# Altium schematic sheet Sheet4.SchDoc
size B; SheetNumber: 4; SheetTotal: 4
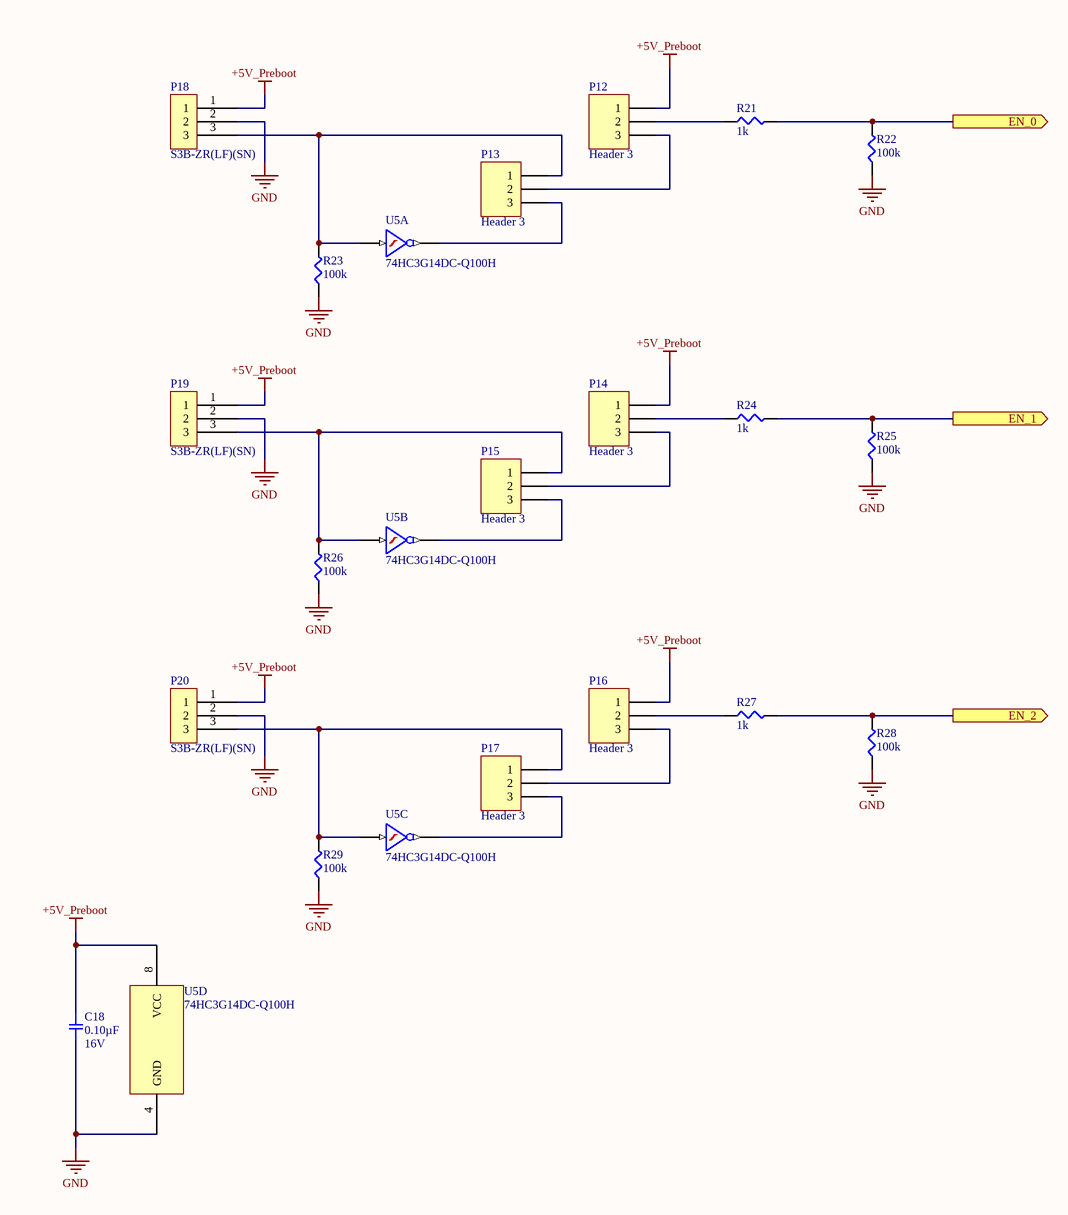
[diagram p0: Sheet4.SchDoc]

## Parts
C18  0.10µF  Voltage: 16V  [SMD-0402C]
P12  Header 3  [HDR1X3]  (no BOM)
P13  Header 3  [HDR1X3]  (no BOM)
P14  Header 3  [HDR1X3]  (no BOM)
P15  Header 3  [HDR1X3]  (no BOM)
P16  Header 3  [HDR1X3]  (no BOM)
P17  Header 3  [HDR1X3]  (no BOM)
P18  S3B-ZR(LF)(SN)  [S3B-ZR(LF)(SN)]
P19  S3B-ZR(LF)(SN)  [S3B-ZR(LF)(SN)]
P20  S3B-ZR(LF)(SN)  [S3B-ZR(LF)(SN)]
R21  1k  [SMD-0402-RES]
R22  100k  [SMD-0402-RES]
R23  100k  [SMD-0402-RES]
R24  1k  [SMD-0402-RES]
R25  100k  [SMD-0402-RES]
R26  100k  [SMD-0402-RES]
R27  1k  [SMD-0402-RES]
R28  100k  [SMD-0402-RES]
R29  100k  [SMD-0402-RES]
U5  74HC3G14DC-Q100H  [TSSOP50P310X100-8N (74HC3G14DC-Q100H)]  (parts A,B,C,D of 4)

## Ports
EN_0 (out), EN_1 (out), EN_2 (out)

## Nets
+5V_Preboot: C18.1 P12.1 P14.1 P16.1 P18.1 P19.1 P20.1 U5.8(VCC)
GND: C18.2 P18.2 P19.2 P20.2 R22.1 R23.1 R25.1 R26.1 R28.1 R29.1 U5.4(GND)
EN_0: R21.2 R22.2 ; port EN_0
EN_1: R24.2 R25.2 ; port EN_1
EN_2: R27.2 R28.2 ; port EN_2
NetP12_2: P12.2 R21.1
NetP12_3: P12.3 P13.2
NetP13_1: P13.1 P18.3 R23.2 U5.1(1A)
NetP13_3: P13.3 U5.7(1Y)
NetP14_2: P14.2 R24.1
NetP14_3: P14.3 P15.2
NetP15_1: P15.1 P19.3 R26.2 U5.3(2A)
NetP15_3: P15.3 U5.5(2Y)
NetP16_2: P16.2 R27.1
NetP16_3: P16.3 P17.2
NetP17_1: P17.1 P20.3 R29.2 U5.6(3A)
NetP17_3: P17.3 U5.2(3Y)

## Notes on the sheet
- Let's Build Rocket's Inc. Modular Paylaod System Based on TMP-010 Rev
  For more information visit https://github.com/LetsBuildRockets/Modular-Payload-System
  This work is licensed under CC BY-NC 4.0. To view a copy of this license, visit https://creativecommons.org/licenses/by-nc/4.0
- Title
- Size:
- Date:
- Assembly Variant:
- B
- Number:
- Time:
- Revision:
- Sheet
- of
- Author:
- File:

## Library data of the parts
C18 = GCM155R71C104KA55D: CAP CER 0.1UF 16V X7R 0402; Manufacturer: Murata Electronics North America; Factory Stock: 0; Unit Price (USD): 0.1; Minimum Quantity: 1; Tolerance: ±10%; Datasheets: http://www.murata.com/~/media/webrenewal/support/library/catalog/products/capacitor/mlcc/c03e.ashx; Image: //media.digikey.com/Renders/Murata%20Renders/ZRB-SERIES-0402.jpg; Digi-Key Part Number: 490-4759-1-ND; Part Number: GCM155R71C104KA55D; Quantity Available: 734194; @ qty: 0; Packaging: Cut Tape (CT); Series: GCM; Part Status: Active; Value: 0.10µF; Temperature Coefficient: X7R; Operating Temperature: -55°C ~ 125°C; Features: -; Ratings: AEC-Q200; Applications: Automotive; Mounting Type: Surface Mount, MLCC; Package / Case: 0402 (1005 Metric); Size / Dimension: 0.039" L x 0.020" W (1.00mm x 0.50mm); Height - Seated (Max): -; Thickness (Max): 0.022" (0.55mm); Lead Spacing: -; Lead Style: -
P12-P17 = Header 3: Header, 3-Pin; LatestRevisionDate: 17-Jul-2002; LatestRevisionNote: Re-released for DXP Platform.; Publisher: Altium Limited
P18-P20 = S3B-ZR(LF)(SN): Unit Price (USD): 0.20
R21 R24 R27 = ERJ-2GEJ102X: RES SMD 1K OHM 5% 1/10W 0402; Manufacturer: Panasonic Electronic Components; Factory Stock: 0; Unit Price (USD): 0.00350; @ qty: 1500; Minimum Quantity: 1; Power (Watts): 0.1W, 1/10W; Temperature Coefficient: ±200ppm/°C; Part Number: ERJ-2GEJ102X; Datasheets: http://industrial.panasonic.com/www-cgi/jvcr13pz.cgi?E+PZ+3+AOA0001+ERJ2GEJ102X+7+WW; Image: //media.digikey.com/Photos/Panasonic%20Photos/ERJ-PA2-Series.jpg; Digi-Key Part Number: P1.0KJCT-ND; Quantity Available: 1939857; Packaging: Cut Tape (CT); Series: ERJ; Part Status: Active; Value: 1k; Tolerance: ±5%; Composition: Thick Film; Features: Automotive AEC-Q200; Operating Temperature: -55°C ~ 155°C; Package / Case: 0402 (1005 Metric); Supplier Device Package: 0402; Size / Dimension: 0.039" L x 0.020" W (1.00mm x 0.50mm); Height - Seated (Max): 0.016" (0.40mm); Number of Terminations: 2; Failure Rate: -
R22 R23 R25 R26 R28 R29 = ERJ-2GEJ104X: RES SMD 100K OHM 5% 1/10W 0402; Manufacturer: Panasonic Electronic Components; Factory Stock: 0; Unit Price (USD): 0.00350; @ qty: 1500; Minimum Quantity: 1; Power (Watts): 0.1W, 1/10W; Temperature Coefficient: ±200ppm/°C; Part Number: ERJ-2GEJ104X; Datasheets: http://industrial.panasonic.com/www-cgi/jvcr13pz.cgi?E+PZ+3+AOA0001+ERJ2GEJ104X+7+WW; Image: //media.digikey.com/Photos/Panasonic%20Photos/ERJ-PA2-Series.jpg; Digi-Key Part Number: P100KJCT-ND; Quantity Available: 2387986; Packaging: Cut Tape (CT); Series: ERJ; Part Status: Active; Value: 100k; Tolerance: ±5%; Composition: Thick Film; Features: Automotive AEC-Q200; Operating Temperature: -55°C ~ 155°C; Package / Case: 0402 (1005 Metric); Supplier Device Package: 0402; Size / Dimension: 0.039" L x 0.020" W (1.00mm x 0.50mm); Height - Seated (Max): 0.016" (0.40mm); Number of Terminations: 2; Failure Rate: -
U5 = 74HC3G14DC-Q100H: Unit Price (USD): 0.66